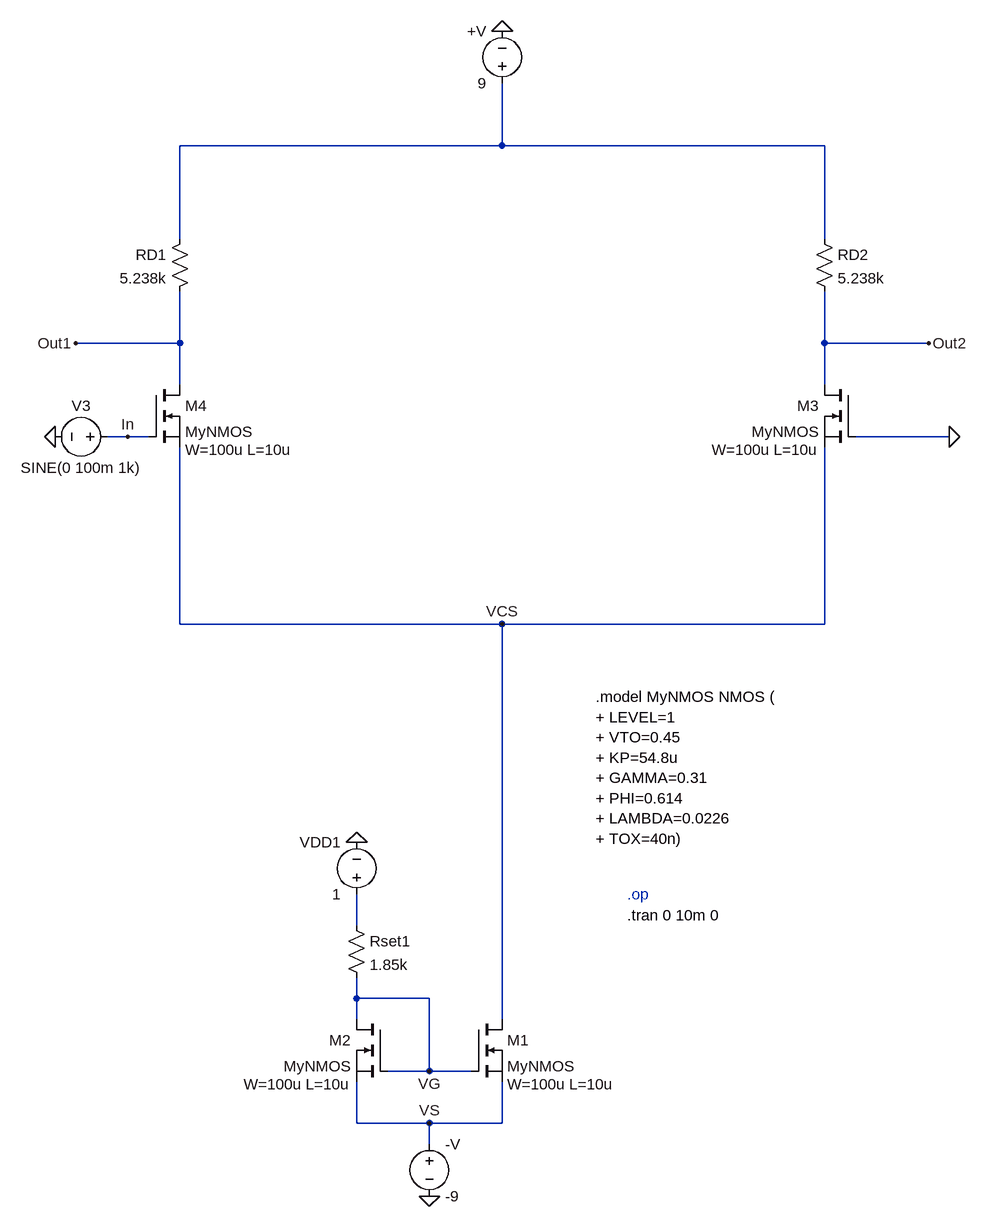
[diagram p0: schematic Diff_Amp_V1.asc]
Diff_Amp_V1.asc, the LTspice schematic file:
Version 4.1
SHEET 1 932 680
WIRE 192 -1200 192 -1296
WIRE 192 -1200 -304 -1200
WIRE 688 -1200 192 -1200
WIRE -304 -1056 -304 -1200
WIRE 688 -1056 688 -1200
WIRE -304 -896 -304 -976
WIRE -304 -896 -464 -896
WIRE 688 -896 688 -976
WIRE 848 -896 688 -896
WIRE -304 -832 -304 -896
WIRE 688 -832 688 -896
WIRE -384 -752 -416 -752
WIRE -352 -752 -384 -752
WIRE 880 -752 736 -752
WIRE -304 -464 -304 -736
WIRE 192 -464 -304 -464
WIRE 688 -464 688 -736
WIRE 688 -464 192 -464
WIRE -32 0 -32 -48
WIRE -32 112 -32 80
WIRE 80 112 -32 112
WIRE -32 144 -32 112
WIRE 192 144 192 -464
WIRE 80 224 80 112
WIRE 80 224 16 224
WIRE 144 224 80 224
WIRE -32 304 -32 240
WIRE 80 304 -32 304
WIRE 192 304 192 240
WIRE 192 304 80 304
WIRE 80 336 80 304
FLAG -32 -128 0
FLAG 80 224 VG
FLAG 80 416 0
FLAG 848 -896 Out2
FLAG -464 -896 Out1
FLAG 192 -1376 0
FLAG 880 -752 0
FLAG -496 -752 0
FLAG -384 -752 In
FLAG 80 304 VS
FLAG 192 -464 VCS
SYMBOL nmos 144 144 R0
WINDOW 39 56 100 Left 2
SYMATTR SpiceLine W=100u L=10u
SYMATTR InstName M1
SYMATTR Value MyNMOS
SYMBOL voltage -32 -32 R180
WINDOW 0 24 96 Left 2
WINDOW 3 24 16 Left 2
WINDOW 123 0 0 Left 0
WINDOW 39 0 0 Left 0
SYMATTR InstName VDD1
SYMATTR Value 1
SYMBOL res -48 -16 R0
SYMATTR InstName Rset1
SYMATTR Value 1.85k
SYMBOL nmos 16 144 M0
WINDOW 39 56 100 Left 2
SYMATTR SpiceLine W=100u L=10u
SYMATTR InstName M2
SYMATTR Value MyNMOS
SYMBOL voltage 80 320 R0
WINDOW 123 0 0 Left 0
WINDOW 39 0 0 Left 0
SYMATTR InstName -V
SYMATTR Value -9
SYMBOL nmos 736 -832 M0
WINDOW 39 56 100 Left 2
SYMATTR SpiceLine W=100u L=10u
SYMATTR InstName M3
SYMATTR Value MyNMOS
SYMBOL nmos -352 -832 R0
WINDOW 39 56 100 Left 2
SYMATTR SpiceLine W=100u L=10u
SYMATTR InstName M4
SYMATTR Value MyNMOS
SYMBOL res 672 -1072 R0
SYMATTR InstName RD2
SYMATTR Value 5.238k
SYMBOL res -288 -1072 M0
SYMATTR InstName RD1
SYMATTR Value 5.238k
SYMBOL voltage 192 -1280 R180
WINDOW 0 24 96 Left 2
WINDOW 3 24 16 Left 2
WINDOW 123 0 0 Left 0
WINDOW 39 0 0 Left 0
SYMATTR InstName +V
SYMATTR Value 9
SYMBOL voltage -400 -752 M270
WINDOW 0 32 56 VTop 2
WINDOW 3 -32 56 VBottom 2
WINDOW 123 0 0 Left 0
WINDOW 39 0 0 Left 0
SYMATTR InstName V3
SYMATTR Value SINE(0 100m 1k)
TEXT 384 -48 Left 2 ;.op
TEXT 336 -352 Left 2 !.model MyNMOS NMOS (\n+ LEVEL=1\n+ VTO=0.45\n+ KP=54.8u\n+ GAMMA=0.31\n+ PHI=0.614\n+ LAMBDA=0.0226\n+ TOX=40n)
TEXT 384 -16 Left 2 !.tran 0 10m 0

The netlist it stands for:
* Diff_Amp_V1.asc
M1 VCS VG VS VS MyNMOS W=100u L=10u
VDD1 N002 0 1
Rset1 N002 VG 1.85k
M2 VG VG VS VS MyNMOS W=100u L=10u
V§-V VS 0 -9
M3 Out2 0 VCS VCS MyNMOS W=100u L=10u
M4 Out1 In VCS VCS MyNMOS W=100u L=10u
RD2 N001 Out2 5.238k
RD1 N001 Out1 5.238k
V§+V N001 0 9
V3 In 0 SINE(0 100m 1k)
.model NMOS NMOS
.model PMOS PMOS
.lib standard.mos
* .op
.model MyNMOS NMOS (
+ LEVEL=1
+ VTO=0.45
+ KP=54.8u
+ GAMMA=0.31
+ PHI=0.614
+ LAMBDA=0.0226
+ TOX=40n)
.tran 0 10m 0
.backanno
.end